# Altium project PCB_Project.PrjPcb
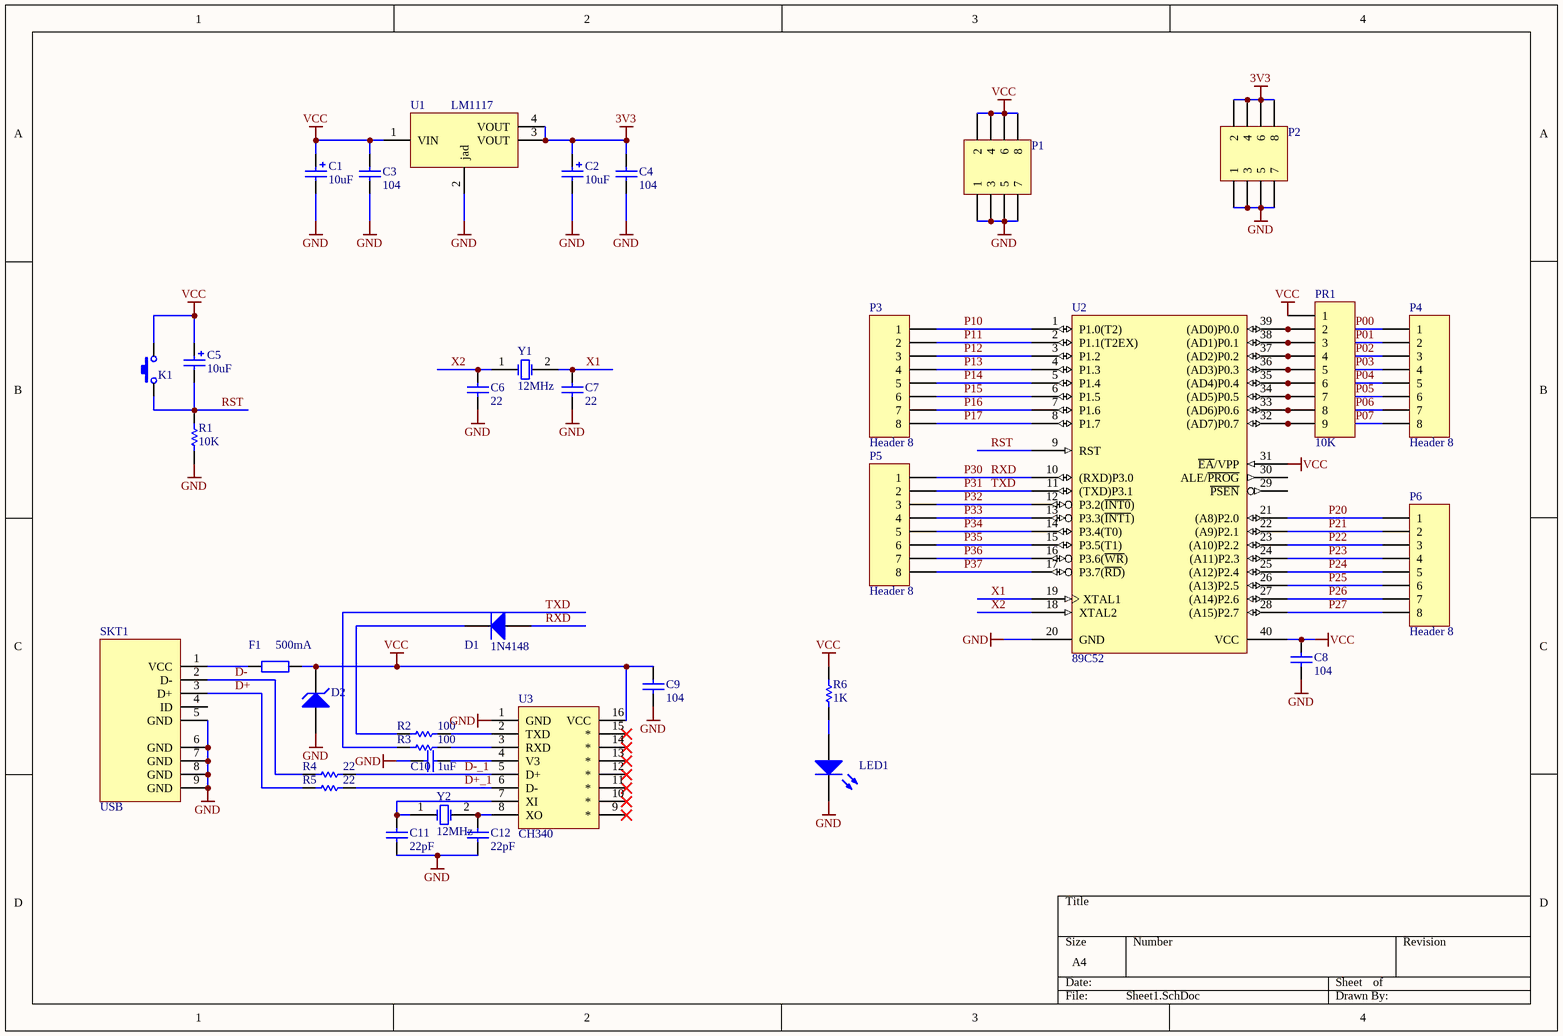
[diagram p0: Sheet1.SchDoc]
1 sheet, 36 parts. Net scope: global (net labels, ports and power ports of the same name join across sheets).
Board file: PCB1.PcbDoc

## Sheet Sheet1.SchDoc
size A4

### Parts
C1  value 10uF  [0805C]  (hidden comment: Cap Pol2)
C2  value 10uF  [0805C]  (hidden comment: Cap Pol2)
C3  value 104  [0805C]  (hidden comment: Cap)
C4  value 104  [0805C]  (hidden comment: Cap)
C5  value 10uF  [0805C]  (hidden comment: Cap Pol2)
C6  value 22  [0805C]  (hidden comment: Cap)
C7  value 22  [0805C]  (hidden comment: Cap)
C8  value 104  [0805C]  (hidden comment: Cap)
C9  value 104  [0805C]  (hidden comment: Cap)
C10  value 1uF  [0805C]  (hidden comment: Cap)
C11  value 22pF  [0805C]  (hidden comment: Cap)
C12  value 22pF  [0805C]  (hidden comment: Cap)
D1  1N4148  [1206D]
D2  D Zener  [DO-214]  (value not drawn)
F1  value 500mA  [0805R]  (hidden comment: Res2)
K1  SW  [IT-1187]  (value not drawn)
LED1  LED3  [LED0805G]  (value not drawn)
P1  Header 4X2  [HDR 2X4]  (value not drawn)
P2  Header 4X2  [HDR 2X4]  (value not drawn)
P3  Header 8  [HDR 1X8]
P4  Header 8  [HDR 1X8]
P5  Header 8  [HDR 1X8]
P6  Header 8  [HDR 1X8]
PR1  10K  [HDR1X9]
R1  value 10K  [0805R]  (hidden comment: Res1)
R2  value 100  [0805R]  (hidden comment: Res1)
R3  value 100  [0805R]  (hidden comment: Res1)
R4  value 22  [0805R]  (hidden comment: Res1)
R5  value 22  [0805R]  (hidden comment: Res1)
R6  value 1K  [0805R]  (hidden comment: Res1)
SKT1  USB  [MicroUSB]
U1  LM1117  [SOT_223]
U2  89C52  [DIP403D]
U3  CH340  [SOIC-16]
Y1  12MHz  [HC49]
Y2  12MHz  [HC49]

### Nets
3V3: C2.1 C4.2 P2.2 P2.4 P2.6 P2.8 U1.3(VOUT) U1.4(VOUT)
GND: C1.2 C2.2 C3.1 C4.1 C6.1 C7.1 C8.1 C9.1 C10.2 C11.2 C12.2 D2.1(A) LED1.2(K) P1.1 P1.3 P1.5 P1.7 P2.1 P2.3 P2.5 P2.7 R1.1 SKT1.5(GND) SKT1.6(GND) SKT1.7(GND) SKT1.8(GND) SKT1.9(GND) U1.2(jad) U2.20(GND) U3.1(GND)
VCC: C1.1 C3.2 C5.1 C8.2 C9.2 D2.2(K) F1.2 K1.2 P1.2 P1.4 P1.6 P1.8 PR1.1 R6.2 U1.1(VIN) U2.31(~{EA}/VPP) U2.40(VCC) U3.16(VCC)
D+: R5.1 SKT1.3(D+)
D+_1: R5.2 U3.6(D-)
D-: R4.1 SKT1.2(D-)
D-_1: R4.2 U3.5(D+)
P00: P4.1 PR1.2 U2.39((AD0)P0.0)
P01: P4.2 PR1.3 U2.38((AD1)P0.1)
P02: P4.3 PR1.4 U2.37((AD2)P0.2)
P03: P4.4 PR1.5 U2.36((AD3)P0.3)
P04: P4.5 PR1.6 U2.35((AD4)P0.4)
P05: P4.6 PR1.7 U2.34((AD5)P0.5)
P06: P4.7 PR1.8 U2.33((AD6)P0.6)
P07: P4.8 PR1.9 U2.32((AD7)P0.7)
P10: P3.1 U2.1(P1.0(T2))
P11: P3.2 U2.2(P1.1(T2EX))
P12: P3.3 U2.3(P1.2)
P13: P3.4 U2.4(P1.3)
P14: P3.5 U2.5(P1.4)
P15: P3.6 U2.6(P1.5)
P16: P3.7 U2.7(P1.6)
P17: P3.8 U2.8(P1.7)
P20: P6.1 U2.21((A8)P2.0)
P21: P6.2 U2.22((A9)P2.1)
P22: P6.3 U2.23((A10)P2.2)
P23: P6.4 U2.24((A11)P2.3)
P24: P6.5 U2.25((A12)P2.4)
P25: P6.6 U2.26((A13)P2.5)
P26: P6.7 U2.27((A14)P2.6)
P27: P6.8 U2.28((A15)P2.7)
P30: D1.1(A) P5.1 U2.10((RXD)P3.0)  [also labelled RXD]
P31: P5.2 R3.1 U2.11((TXD)P3.1)  [also labelled TXD]
P32: P5.3 U2.12(P3.2(~{INT0}))
P33: P5.4 U2.13(P3.3(~{INT1}))
P34: P5.5 U2.14(P3.4(T0))
P35: P5.6 U2.15(P3.5(T1))
P36: P5.7 U2.16(P3.6(~{WR}))
P37: P5.8 U2.17(P3.7(~{RD}))
RST: C5.2 K1.1 R1.2 U2.9(RST)
X1: C7.2 U2.19(XTAL1) Y1.2(OSC2)
X2: C6.2 U2.18(XTAL2) Y1.1(OSC1)
NetC10_1: C10.1 U3.4(V3)
NetC11_1: C11.1 U3.7(XI) Y2.1(OSC1)
NetC12_1: C12.1 U3.8(XO) Y2.2(OSC2)
NetD1_2: D1.2(K) R2.1
NetF1_1: F1.1 SKT1.1(VCC)
NetLED1_1: LED1.1(A) R6.1
NetR2_2: R2.2 U3.2(TXD)
NetR3_2: R3.2 U3.3(RXD)

Not connected (* = marked no-connect by the designer): SKT1 4(ID); U2 29(~{PSEN}) 30(ALE/~{PROG}); U3 9(*)* 10(*)* 11(*)* 12(*)* 13(*)* 14(*)* 15(*)*

### Library data of the parts
C1 C2 C5 = Cap Pol2: Polarized Capacitor (Axial); Published: 8-Jun-2000; LatestRevisionDate: 17-Jul-2002; LatestRevisionNote: Re-released for DXP Platform.; PackageReference: POLAR0.8; Publisher: Altium Limited; PackageDescription: Polarized Capacitor; 2 Leads
C3 C4 C6-C12 = Cap: Capacitor; Published: 8-Jun-2000; LatestRevisionDate: 17-Jul-2002; LatestRevisionNote: Re-released for DXP Platform.; PackageReference: RAD-0.3; Publisher: Altium Limited; PackageDescription: Radial Cap, Thru-Hole; 2 Leads; 0.3 in Pin Spacing
D1 = Diode 1N4148: High Conductance Fast Diode; Published: 8-Jun-2000; LatestRevisionDate: 17-Jul-2002; LatestRevisionNote: Re-released for DXP Platform.; DatasheetVersion: 1997; PackageReference: DO-35; Publisher: Altium Limited; PackageDescription: Diode, Axial; Body 3.8 x 1.9 mm (LxDia. max), Lead Dia. 0.53 mm (max); Code_JEDEC: DO-204-AH; ComponentLink1Description: Manufacturer Link; ComponentLink1URL: http://www.fairchildsemi.com/; ComponentLink2Description: Datasheet; ComponentLink2URL: http://www.fairchildsemi.com/ds/1N%2F1N4148.pdf
D2 = D Zener: Zener Diode; Published: 8-Jun-2000; LatestRevisionDate: 17-Jul-2002; LatestRevisionNote: Re-released for DXP Platform.; PackageReference: DIODE-0.7; Publisher: Altium Limited; PackageDescription: Diode, Thru-Hole; 2 Leads; 0.7 in Pin Spacing
F1 = Res2: Resistor; Published: 8-Jun-2000; LatestRevisionDate: 17-Jul-2002; LatestRevisionNote: Re-released for DXP Platform.; PackageReference: AXIAL-0.4; Publisher: Altium Limited; PackageDescription: Axial Device, Thru-Hole; 2 Leads; 0.4 in Pin Spacing
LED1 = LED3: Typical BLUE SiC LED; Published: 8-Jun-2000; LatestRevisionDate: 17-Dec-2003; LatestRevisionNote: PCB Footprint replaced.; DatasheetVersion: 16-Apr-2002; PackageVersion: 16-Apr-2002; PackageReference: 3.5X2.8X1.9; Publisher: Altium Limited; PackageDescription: SM LED; 2 C-Bend Leads; Body 3.5 x 2.8 x 1.9 mm, inc leads (LxWxH typ)
P1 P2 = Header 4X2: Header, 4-Pin, Dual row; LatestRevisionDate: 17-Jul-2002; LatestRevisionNote: Re-released for DXP Platform.; Publisher: Altium Limited
P3-P6 = Header 8: Header, 8-Pin; LatestRevisionDate: 17-Jul-2002; LatestRevisionNote: Re-released for DXP Platform.; Publisher: Altium Limited
PR1 = Header 9: Header, 9-Pin; LatestRevisionDate: 17-Jul-2002; LatestRevisionNote: Re-released for DXP Platform.; Publisher: Altium Limited
R1-R6 = Res1: Resistor; Published: 8-Jun-2000; LatestRevisionDate: 17-Jul-2002; LatestRevisionNote: Re-released for DXP Platform.; PackageReference: AXIAL-0.3; Publisher: Altium Limited; PackageDescription: Axial Device, Thru-Hole; 2 Leads; 0.3 in Pin Spacing
SKT1 = Micro USB
U1 = 1117
Y1 Y2 = XTAL: Crystal Oscillator; Published: 8-Jun-2000; LatestRevisionDate: 17-Jul-2002; LatestRevisionNote: Re-released for DXP Platform.; PackageReference: R38; Publisher: Altium Limited; PackageDescription: Crystal, Thru-Hole; 2 Leads; Body 3.1 x 8.2 mm (Dia.xH)